# Altium schematic sheet Battery Charger.SchDoc: Battery Charger
size A4; Author: Patryk Bujak; DrawnBy: Patryk Bujak; DocumentNumber: 12; Revision: 1.0; SheetNumber: 8; SheetTotal: 10
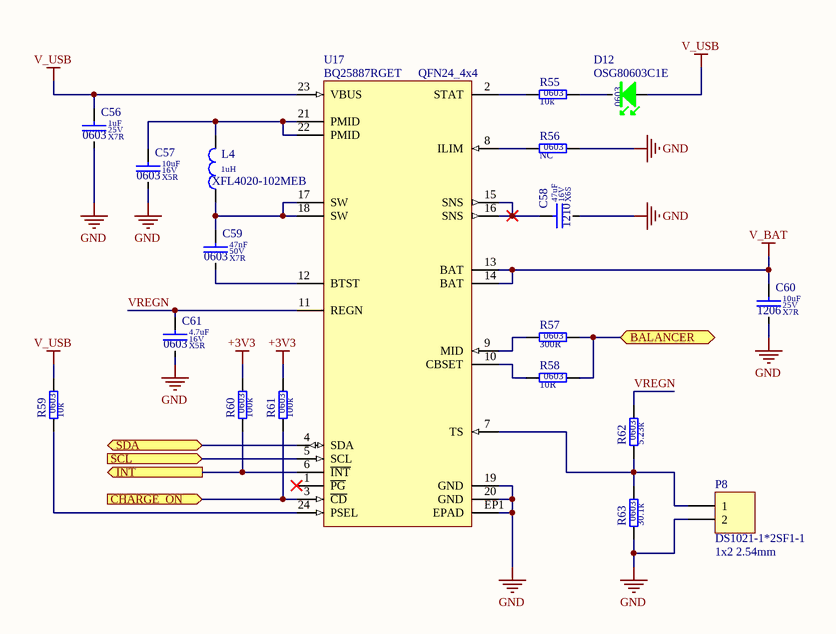
[diagram p0: Battery Charger.SchDoc]

## Parts
C56  value 1uF  Dielectric: X7R  Voltage: 25V  SCH_Footprint: 0603  [C_0603_1608]  (hidden comment: Ceramic X7R)
C57  value 10uF  Dielectric: X5R  Voltage: 16V  SCH_Footprint: 0603  [C_0603_1608]  (hidden comment: Ceramic X5R)
C58  value 47uF  Dielectric: X6S  Voltage: 16V  SCH_Footprint: 1210  [C_1210_3225]  (hidden comment: Ceramic X6S)
C59  value 47nF  Dielectric: X7R  Voltage: 50V  SCH_Footprint: 0603  [C_0603_1608]  (hidden comment: Ceramic X7R)
C60  value 10uF  Dielectric: X7R  Voltage: 25V  SCH_Footprint: 1206  [C_1206_3216]  (hidden comment: Ceramic X7R)
C61  value 4.7uF  Dielectric: X5R  Voltage: 16V  SCH_Footprint: 0603  [C_0603_1608]  (hidden comment: Ceramic X5R)
D12  value OSG80603C1E  SCH_Footprint: 0603  [OL_0603_1608]  (hidden comment: Green led)
L4  value 1uH  SCH_Footprint: XFL4020-102MEB  [XFL4020]  (hidden comment: Inductor)
P8  value DS1021-1*2SF1-1  SCH_Footprint: 1x2 2.54mm  [P_HEADER_1x2_2.54]  (hidden comment: Goldpin)
R55  value 10k  SCH_Footprint: 0603  [R_0603_1608]  (hidden comment: Resistor)
R56  value NC  SCH_Footprint: 0603  [R_NC_0603_1608]  (hidden comment: Resistor)
R57  value 300R  SCH_Footprint: 0603  [R_0603_1608]  (hidden comment: Resistor)
R58  value 10R  SCH_Footprint: 0603  [R_0603_1608]  (hidden comment: Resistor)
R59  value 10k  SCH_Footprint: 0603  [R_0603_1608]  (hidden comment: Resistor)
R60  value 100k  SCH_Footprint: 0603  [R_0603_1608]  (hidden comment: Resistor)
R61  value 100k  SCH_Footprint: 0603  [R_0603_1608]  (hidden comment: Resistor)
R62  value 5.23k  SCH_Footprint: 0603  [R_0603_1608]  (hidden comment: Resistor)
R63  value 30.1k  SCH_Footprint: 0603  [R_0603_1608]  (hidden comment: Resistor)
U17  value BQ25887RGET  [QFN24_4x4]  (hidden comment: BQ25887 I2C Controlled 2-Cell, 2-A Boost-Mode Battery Charger With Cell Balancing For USB Input)

## Ports
BALANCER (bidir), CHARGE_ON (in), INT (out), SCL (in), SDA (bidir)

## Nets
+3V3: R60.2 R61.2
GND: C56.2 C57.2 C58.2 C60.2 C61.2 P8.2 R56.2 R63.1 U17.19(GND) U17.20(GND) U17.EP1(EPAD)
V_BAT: C60.1 U17.13(BAT) U17.14(BAT)
V_USB: C56.1 D12.2(A) R59.2 U17.23(VBUS)
BALANCER: R57.2 R58.2 ; port BALANCER
CHARGE_ON: R61.1 U17.3(~{CD}) ; port CHARGE_ON
INT: R60.1 U17.6(~{INT}) ; port INT
SCL: U17.5(SCL) ; port SCL
SDA: U17.4(SDA) ; port SDA
VREGN: C61.1 R62.2 U17.11(REGN)
NetC57_1: C57.1 L4.2 U17.21(PMID) U17.22(PMID)
NetC58_1: C58.1 U17.15(SNS) U17.16(SNS)
NetC59_1: C59.1 L4.1 U17.17(SW) U17.18(SW)
NetC59_2: C59.2 U17.12(BTST)
NetD12_1: D12.1(K) R55.2
NetP8_1: P8.1 R62.1 R63.2 U17.7(TS)
NetR55_1: R55.1 U17.2(STAT)
NetR56_1: R56.1 U17.8(ILIM)
NetR57_1: R57.1 U17.9(MID)
NetR58_1: R58.1 U17.10(CBSET)
NetR59_1: R59.1 U17.24(PSEL)

Not connected (* = marked no-connect by the designer): U17 1(~{PG})*

## Notes on the sheet
- Title:
- Sheet:
- of
- Author:
- Model:
- Document Number:
- Checked by:
- Iss-Rev:
- Approved by:
- Date:
- File name:

## Library data of the parts
C56 = C_1uF_25V_X7R_0603_10: Capacitor; Manufacturer: Samsung; Manufacturer Part Number: CL10B105KA8NNNC; Tolerance (%): 10; Part Number: C_1uF_25V_X7R_0603_10; HelpURL: http://www.tme.eu/pl/Document/4a42202b32dab16128fe107dd69598cc/samsung-chip-cap.pdf; Supplier 1: TME; Supplier Part Number 1: CL10B105KA8NNNC; Supplier 2: RS Components; Supplier 3: Farnell; Supplier 4: Mouser; Supplier 5: Digi-Key
C57 = C_10uF_16V_X5R_0603_20: Capacitor; Manufacturer: Samsung Electro-Mechanics; Manufacturer Part Number: CL10A106MO8NQNC; Tolerance (%): 20; Part Number: C_10uF_16V_X5R_0603_20; HelpURL: http://www.tme.eu/pl/Document/4a42202b32dab16128fe107dd69598cc/samsung-chip-cap.pdf; Supplier 1: TME; Supplier Part Number 1: CL10A106MO8NQNC; Supplier 2: RS Components; Supplier 3: Farnell; Supplier 4: Mouser; Supplier 5: Digi-Key
C58 = C_47uF_16V_X6S_1210_10: Capacitor; Manufacturer: Murata; Manufacturer Part Number: GRM32EC81C476KE15L; Tolerance (%): 10; Part Number: C_47uF_16V_X6S_1210_10; HelpURL: https://datasheet.octopart.com/GRM32EC81C476KE15L-Murata-datasheet-138746852.pdf; Supplier 1: TME; Supplier 2: RS Components; Supplier Part Number 2: 8467369; Supplier 3: Farnell; Supplier Part Number 3: 1907527; Supplier 4: Mouser; Supplier Part Number 4: 81-GRM32EC81C476KE5L; Supplier 5: Digi-Key; Supplier Part Number 5: 490-10531-1-ND
C59 = C_47nF_50V_X7R_0603_10: Capacitor; Manufacturer: Vishay; Manufacturer Part Number: VJ0603Y473KXACW1BC; Tolerance (%): 10; Part Number: C_47nF_50V_X7R_0603_10; HelpURL: https://www.tme.eu/Document/6a5ad7ac81542ad65ce1ca82bcd21ffa/vjw1bcbascomseries.pdf; Supplier 1: TME; Supplier Part Number 1: VJ0603Y473KXACW1BC; Supplier 2: RS Components; Supplier 3: Farnell; Supplier Part Number 3: 2896456; Supplier 4: Mouser; Supplier Part Number 4: 77-VJ0603Y473KXACBC; Supplier 5: Digi-Key; Supplier Part Number 5: 720-1697-1-ND
C60 = C_10uF_25V_X7R_1206_10: Capacitor; Manufacturer: Samsung Electro-Mechanics; Manufacturer Part Number: CL31B106KAHNNNE; Tolerance (%): 10; Part Number: C_10uF_25V_X7R_1206_10; HelpURL: http://www.tme.eu/pl/Document/4a42202b32dab16128fe107dd69598cc/samsung-chip-cap.pdf; Supplier 1: TME; Supplier Part Number 1: CL31B106KAHNNNE; Supplier 2: RS Components; Supplier 3: Farnell; Supplier 4: Mouser; Supplier 5: Digi-Key
C61 = C_4.7uF_16V_X5R_0603_10: Capacitor; Manufacturer: Murata; Manufacturer Part Number: GRM188R61C475KAAJD; Tolerance (%): 10; Part Number: C_4.7uF_16V_X5R_0603_10; HelpURL: https://datasheet.octopart.com/GRM188R61C475KAAJD-Murata-datasheet-66077093.pdf; Supplier 1: TME; Supplier 2: RS Components; Supplier Part Number 2: 884-7264P; Supplier 3: Farnell; Supplier Part Number 3: 2611924; Supplier 4: Mouser; Supplier Part Number 4: 81-GRM188R61C475KAJD; Supplier 5: Digi-Key; Supplier Part Number 5: 490-10481-2-ND
D12 = OL_G_0603_OSG80603C1E: LED GREEN; Manufacturer: Optosupply; Part Number: OL_G_0603_OSG80603C1E; Manufacturer Part Number: OSG80603C1E; Supplier 1: TME; Supplier Part Number 1: OSG80603C1E; Supplier 2: RS Components; Supplier 3: Farnell; Supplier 4: Mouser; Supplier 5: Digi-Key
L4 = LM_1uH_11A_XFL4020-102MEB: Induction; Manufacturer: Coilcraft; Current: 11A; Resistance: 11.9mR; Part Number: LM_1uH_11A_XFL4020-102MEB; HelpURL: https://datasheet.octopart.com/XFL4020-102MEB-Coilcraft-datasheet-10792328.pdf; Manufacturer Part Number: XFL4020-102MEB; Supplier 1: TME; Supplier 2: RS Components; Supplier 3: Farnell; Supplier 4: Mouser; Supplier Part Number 4: 994-XFL4020-102MEB; Supplier 5: Digi-Key; Supplier 6: Coilcfrat; Supplier Part Number 6: XFL4020-102MEB
P8 = P_HEADER_1x2_2.54: Header, 2-Pin; Manufacturer: Connfly; Part Number: P_HEADER_1x2_2.54; Component Type: Standard; HelpURL: http://www.tme.eu/en/Document/cc301e58a5da78cb543a94b5a5b7f06a/DS1021.pdf; Manufacturer Part Number: DS1021-1*2SF1-1; Supplier 1: TME; Supplier Part Number 1: ZL201-02G; Supplier 2: RS Components; Supplier 3: Farnell; Supplier 4: Mouser; Supplier 5: Digi-Key
R55 R59 = R_10k_0603_1: Manufacturer: Vishay; Manufacturer Part Number: CRCW060310K0FKTABC; Voltage: 75V; Power: 100mW; Tolerance: 1%; Part Number: R_10k_0603_1; HelpURL: http://www.tme.eu/pl/Document/622e28308c06d160637f2b14751ba16b/Data%20Sheet%20CRCW_BCe3.pdf; Supplier 1: TME; Supplier Part Number 1: CRCW060310K0FKTABC; Supplier 2: RS Components; Supplier 3: Farnell; Supplier 4: Mouser; Supplier Part Number 4: 667-ERJ-3EKF1002V; Supplier 5: Digi-Key; Supplier Part Number 5: P10KGCT-ND
R56 = R_GENERIC_0603: Part Number: R_GENERIC_0603; Supplier 1: TME; Supplier 2: RS Components; Supplier 3: Farnell; Supplier 4: Mouser; Supplier 5: Digi-Key
R57 = R_300R_0603_1: Manufacturer: Yageo; Manufacturer Part Number: RC0603FR-07300RL; Voltage: 50V; Power: 100mW; Tolerance: 1%; Part Number: R_300R_0603_1; HelpURL: https://www.tme.eu/Document/d2a72e545e5c8eb7bf2a04fa97535928/rc0603yageo.pdf; Supplier 1: TME; Supplier Part Number 1: RC0603FR-07300R; Supplier 2: RS Components; Supplier 3: Farnell; Supplier Part Number 3: 2413696; Supplier 4: Mouser; Supplier Part Number 4: 603-RC0603FR-07300RL; Supplier 5: Digi-Key; Supplier Part Number 5: 311-300HRCT-ND
R58 = R_10R_0603_1: Manufacturer: Royalohm; Manufacturer Part Number: 0603SAF100JT5E; Voltage: 50V; Power: 100mW; Tolerance: 1%; Part Number: R_10R_0603_1; HelpURL: http://www.tme.eu/pl/Document/b315665a56acbc42df513c99b390ad98/ROYALOHM-THICKFILM.pdf; Supplier 1: TME; Supplier Part Number 1: SMD0603-10R-1%; Supplier 2: RS Components; Supplier 3: Farnell; Supplier 4: Mouser; Supplier 5: Digi-Key
R60 R61 = R_100k_0603_1: Manufacturer: Royalohm; Manufacturer Part Number: 0603SAF1003T5E; Voltage: 50V; Power: 100mW; Tolerance: 1%; Part Number: R_100k_0603_1; HelpURL: http://www.tme.eu/pl/Document/b315665a56acbc42df513c99b390ad98/ROYALOHM-THICKFILM.pdf; Supplier 1: TME; Supplier Part Number 1: SMD0603-100K-1%; Supplier 2: RS Components; Supplier 3: Farnell; Supplier 4: Mouser; Supplier Part Number 4: 667-ERJ-3EKF1003V; Supplier 5: Digi-Key; Supplier Part Number 5: P100KHCT-ND
R62 = R_5.23k_0603_1: Manufacturer: Royalohm; Manufacturer Part Number: 0603SAF5232T5E; Voltage: 50V; Power: 100mW; Tolerance: 1%; Part Number: R_5.23k_0603_1; HelpURL: https://www.tme.eu/Document/9e42ba54d36a9bd3dfa2901986ac022d/rezystor-smd.pdf; Supplier 1: TME; Supplier Part Number 1: SMD0603-52.3K-1%; Supplier 2: RS Components; Supplier 3: Farnell; Supplier 4: Mouser; Supplier 5: Digi-Key
R63 = R_30.1k_0603_1: Manufacturer: Vishay; Manufacturer Part Number: CRCW060330K1FKTABC; Voltage: 75V; Power: 100mW; Tolerance: 1%; Part Number: R_30.1k_0603_1; HelpURL: https://www.tme.eu/Document/622e28308c06d160637f2b14751ba16b/Data%20Sheet%20CRCW_BCe3.pdf; Supplier 1: TME; Supplier Part Number 1: CRCW060330K1FKTABC; Supplier 2: RS Components; Supplier 3: Farnell; Supplier 4: Mouser; Supplier Part Number 4: 71-CRCW0603-30.1K; Supplier 5: Digi-Key; Supplier Part Number 5: CRCW060330K1FKTA-ND
U17 = U_BQ25887RGET: Manufacturer: Texas Instruments; SCH_Footprint: QFN24_4x4; Part Number: U_BQ25887RGET; HelpURL: http://www.ti.com/lit/ds/symlink/bq25887.pdf; Manufacturer Part Number: BQ25887RGET; Supplier 1: TME; Supplier 2: RS Components; Supplier 3: Farnell; Supplier 4: Mouser; Supplier Part Number 4: 595-BQ25887RGET; Supplier 5: Digi-Key; Supplier Part Number 5: 296-53518-1-ND